# Altium schematic sheet 16_LMS2_RF2_Misc.SchDoc: LMS2 RF2 Misc
size A3; Organization: Lime Microsystems; Address1: Surrey Tech Centre; Address2: Guildford GU2 7YG; Address3: Surrey; Address4: United Kingdom; Revision: v1.1; SheetNumber: 16; SheetTotal: 31
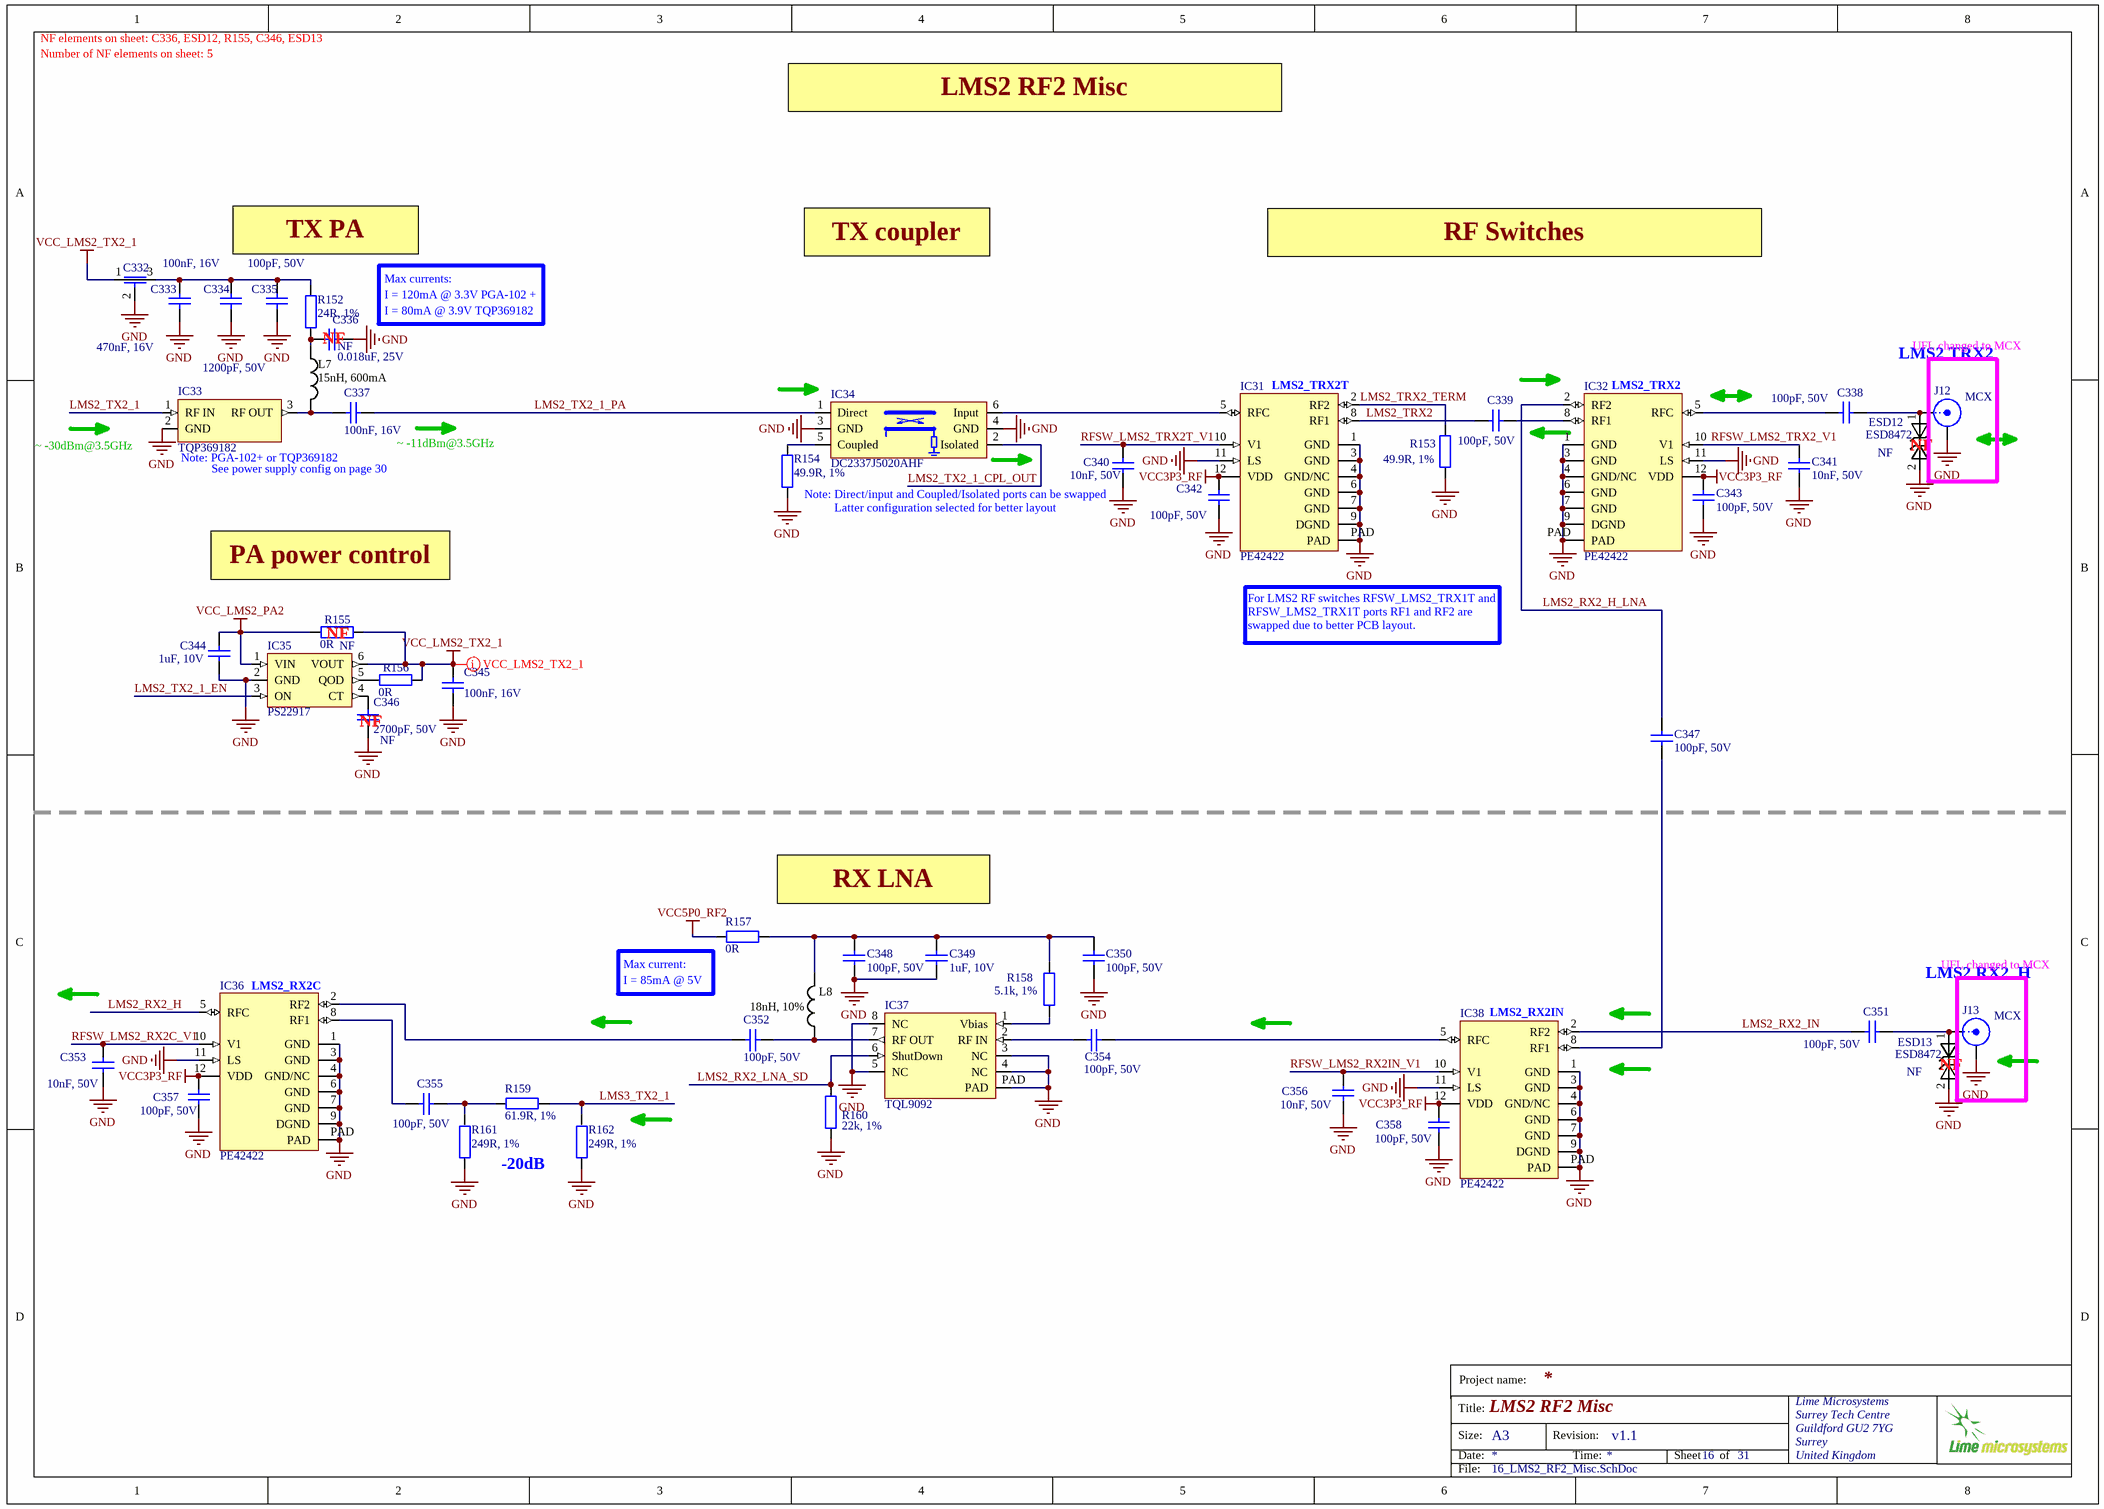
[diagram p0: 16_LMS2_RF2_Misc.SchDoc]

## Parts
C332  470nF, 16V  [CAP0805_FEEDTHROUGH]
C333  100nF, 16V  [CAP0402]
C334  1200pF, 50V  [CAP0402]
C335  100pF, 50V  [CAP0402]
C336  0.018uF, 25V  Assembly Info: NF  [CAP0402]
C337  100nF, 16V  [CAP0402]
C338  100pF, 50V  [CAP0402]
C339  100pF, 50V  [CAP0402]
C340  10nF, 50V  [CAP0402]
C341  10nF, 50V  [CAP0402]
C342  100pF, 50V  [CAP0402]
C343  100pF, 50V  [CAP0402]
C344  1uF, 10V  [CAP0402]
C345  100nF, 16V  [CAP0402]
C346  2700pF, 50V  Assembly Info: NF  [CAP0402]
C347  100pF, 50V  [CAP0402]
C348  100pF, 50V  [CAP0402]
C349  1uF, 10V  [CAP0402]
C350  100pF, 50V  [CAP0402]
C351  100pF, 50V  [CAP0402]
C352  100pF, 50V  [CAP0402]
C353  10nF, 50V  [CAP0402]
C354  100pF, 50V  [CAP0402]
C355  100pF, 50V  [CAP0402]
C356  10nF, 50V  [CAP0402]
C357  100pF, 50V  [CAP0402]
C358  100pF, 50V  [CAP0402]
ESD12  ESD8472  Assembly Info: NF  [ESD8472_X3DFN2]
ESD13  ESD8472  Assembly Info: NF  [ESD8472_X3DFN2]
IC31  PE42422  [PE42422_QFN12]
IC32  PE42422  [PE42422_QFN12]
IC33  TQP369182  [PGA-102+_SOT89]
IC34  DC2337J5020AHF  [DC2337J5020AHF_ANAREN_COUPLER_0805]
IC35  PS22917  [SOT23-6]
IC36  PE42422  [PE42422_QFN12]
IC37  TQL9092  [TQL9092]
IC38  PE42422  [PE42422_QFN12]
J12  MCX  [MCX_connector_vertical_SM]
J13  MCX  [MCX_connector_vertical_SM]
L7  15nH, 600mA  [RES0805]
L8  18nH, 10%  [RES0603]
R152  24R, 1%  [RES0402]
R153  49.9R, 1%  [RES0402]
R154  49.9R, 1%  [RES0402]
R155  0R  Assembly Info: NF  [RES0402]
R156  0R  [RES0402]
R157  0R  [RES0402]
R158  5.1k, 1%  [RES0603]
R159  61.9R, 1%  [RES0402]
R160  22k, 1%  [RES0402]
R161  249R, 1%  [RES0402]
R162  249R, 1%  [RES0402]

## Nets
GND: C332.2 C333.1 C334.2 C335.2 C336.2 C340.2 C341.2 C342.1 C343.1 C344.1 C345.1 C346.2 C348.2 C349.1 C350.2 C353.2 C356.2 C357.1 C358.1 ESD12.2 ESD13.2 IC31.1(GND) IC31.3(GND) IC31.4(GND/NC) IC31.6(GND) IC31.7(GND) IC31.9(DGND) IC31.11(LS) IC31.PAD IC32.1(GND) IC32.3(GND) IC32.4(GND/NC) IC32.6(GND) IC32.7(GND) IC32.9(DGND) IC32.11(LS) IC32.PAD IC33.2(GND) IC34.3(GND) IC34.4(GND) IC35.2(GND) IC36.1(GND) IC36.3(GND) IC36.4(GND/NC) IC36.6(GND) IC36.7(GND) IC36.9(DGND) IC36.11(LS) IC36.PAD IC37.3(NC) IC37.4(NC) IC37.5(NC) IC37.8(NC) IC37.PAD IC38.1(GND) IC38.3(GND) IC38.4(GND/NC) IC38.6(GND) IC38.7(GND) IC38.9(DGND) IC38.11(LS) IC38.PAD J12.2(Y) J13.2(Y) R153.2 R154.2 R160.1 R161.1 R162.1
VCC3P3_RF: C342.2 C343.2 C357.2 C358.2 IC31.12(VDD) IC32.12(VDD) IC36.12(VDD) IC38.12(VDD)
VCC5P0_RF2: R157.1
VCC_LMS2_PA2: C344.2 IC35.1(VIN) R155.2
VCC_LMS2_TX2_1: C332.1 C345.2 IC35.6(VOUT) R155.1 R156.1
LMS2_RX2_H: IC36.5(RFC)
LMS2_RX2_H_LNA: C347.2 IC32.2(RF2)
LMS2_RX2_IN: C351.1 IC38.2(RF2)
LMS2_RX2_LNA_SD: IC37.6(ShutDown) R160.2
LMS2_TRX2: C339.1 IC31.8(RF1)
LMS2_TRX2_TERM: IC31.2(RF2) R153.1
LMS2_TX2_1: IC33.1(RF_IN)
LMS2_TX2_1_CPL_OUT: IC34.2(Isolated)
LMS2_TX2_1_EN: IC35.3(ON)
LMS2_TX2_1_PA: C337.1 IC34.1(Direct)
LMS3_TX2_1: R159.2 R162.2
RFSW_LMS2_RX2C_V1: C353.1 IC36.10(V1)
RFSW_LMS2_RX2IN_V1: C356.1 IC38.10(V1)
RFSW_LMS2_TRX2_V1: C341.1 IC32.10(V1)
RFSW_LMS2_TRX2T_V1: C340.1 IC31.10(V1)
NetC332_3: C332.3 C333.2 C334.1 C335.1 R152.1
NetC336_1: C336.1 L7.1 R152.2
NetC337_2: C337.2 IC33.3(RF_OUT) L7.2
NetC338_1: C338.1 IC32.5(RFC)
NetC338_2: C338.2 ESD12.1 J12.1(X)
NetC339_2: C339.2 IC32.8(RF1)
NetC346_1: C346.1 IC35.4(CT)
NetC347_1: C347.1 IC38.8(RF1)
NetC348_1: C348.1 C349.2 C350.1 L8.1 R157.2 R158.2
NetC351_2: C351.2 ESD13.1 J13.1(X)
NetC352_1: C352.1 IC36.2(RF2)
NetC352_2: C352.2 IC37.7(RF_OUT) L8.2
NetC354_1: C354.1 IC37.2(RF_IN)
NetC354_2: C354.2 IC38.5(RFC)
NetC355_1: C355.1 R159.1 R161.2
NetC355_2: C355.2 IC36.8(RF1)
NetIC31_5: IC31.5(RFC) IC34.6(Input)
NetIC34_5: IC34.5(Coupled) R154.1
NetIC35_5: IC35.5(QOD) R156.2
NetIC37_1: IC37.1(Vbias) R158.1

## Layout directives
net class VCC_LMS2_TX2_2: VCC_LMS2_TX2_1

## Notes on the sheet
- NF elements on sheet: C336, ESD12, R155, C346, ESD13
- Number of NF elements on sheet: 5
- LMS2 RF2 Misc
- TX PA
- (near C332) Ch2
- I = 120mA @ 3.3V PGA-102 +
- Max currents:
- I = 80mA @ 3.9V TQP369182
- TX coupler
- RF Switches
- NF
- LMS2 TRX2
- UFL changed to MCX
- (near IC33) ~ -30dBm@3.5GHz
- (near C337) ~ -11dBm@3.5GHz
- (near IC31) LMS2_TRX2T
- (near IC32) LMS2_TRX2
- (near ESD12) NF
- (near IC33) Note: PGA-102+ or TQP369182
- See power supply config on page 30
- Note: Direct/input and Coupled/Isolated ports can be swapped
- (near C340) Latter configuration selected for better layout
- PA power control
- (near R155) NF
- (near IC31) For LMS2 RF switches RFSW_LMS2_TRX1T and RFSW_LMS2_TRX1T ports RF1 and RF2 are swapped due to better PCB layout.
- (near C346) NF
- RX LNA
- (near IC36) LMS2_RX2C
- I = 85mA @ 5V
- (near R157) Max current:
- LMS2 RX2_H
- (near IC38) LMS2_RX2IN
- (near ESD13) NF
- -20dB
- Project name:
- Title:
- Size:
- Date:
- A3
- Revision:
- Time:
- Sheet
- of
- File:

## Library data of the parts
C332 = Cap_feed_through: Part Description: 0.47µF Feed Through Capacitor 16V 2A 30mOhm 0805 (2012 Metric), 3 PC Pad; Manufacturer: Murata; Manufacturer Part Number 1: NFM21PC474R1C3D; Max Current Rating: 2A; Tolerance: 20%; DC Resistance (DCR): 30mR; Insulation Resistance: 1GR; Value: 470nF, 16V; Supplier 1: Digi-Key; Supplier Part Number 1: 490-2537-1-ND; Stock 1: 220606; Pricing 1: 1=0,25000, 10=0,22900, 25=0,21840, 50=0,21160, 100=0,20450, 250=0,19392, 500=0,16218, 1000=0,12586 (USD); Mount: Surface Mount,PCB; Case/Package: 0805; Weight: 0.000194oz; Case Code (Metric): 2012; Case Code (Imperial): 0805; Min Operating Temperature: -55°C; Max Operating Temperature: 125°C; Package Quantity: 1; Capacitance: 470nF; Packaging: Tape and Reel; Max Voltage Rating (DC): 16V; Current Rating: 2A; Voltage Rating: 16V; Voltage Rating (DC): 16V; Voltage: 16V; Current: 2A; Termination: Flat; Length: 2mm; Height: 0.85mm; Width: 1.25mm; Depth: 1.25mm; Radiation Hardening: No; REACH SVHC: No SVHC; Lead Free: Lead Free; RoHS: Yes
C333 C337 C345 = Cap_0402: Manufacturer: Murata Electronics; Manufacturer Part Number 1: GRM155R71C104KA88D; Part Description: 0.10µF ±10% 16V X7R Ceramic Capacitor -55°C ~ 125°C Surface Mount, MLCC 0402 (1005 Metric) 0.039" L x 0.020" W (1.00mm x 0.50mm); Tolerance: 10 %; Type: General Purpose MLCC; Capacitance: 0.1 uF; Case Length: 1 mm; Dielectric: X7R; Case Height: 0.5 mm; Temperature Coefficient / Code: +/- 15 %; Value: 100nF, 16V; Supplier 1: Mouser; Supplier Part Number 1: 81-GRM155R71C104KA88; Case Code - in: 0402; RoHS: RoHS Compliant; Operating Temperature Range: - 55 C to + 125 C; Series: GRM; Termination Style: SMD/SMT; Package / Case: 0402 (1005 metric); Voltage Rating DC: 16 V; Maximum Operating Temperature: + 125 C; Case Code - mm: 1005; Minimum Operating Temperature: - 55 C; Product Category: Low & Medium Capacitance SMD Ceramic Chip Capacitors; Packaging: Reel; Product: General Type MLCCs; Category: Multilayer Ceramic Capacitors MLCC - SMD/SMT; Brand: Murata Electronics; Case Width: 0.5 mm; RoHS - Mouser: Y; Standard Pack Qty: 10000; Minimum Order Quantity: 1; Reeling: True
C334 = Cap_0402: Manufacturer: Kemet; Manufacturer Part Number 1: C0402C122J5GACTU; Part Description: 1200pF ±5% 50V Ceramic Capacitor C0G, NP0 0402 (1005 Metric); Temperature Coefficient: C0G, NP0; Tolerance: ±5%; Value: 1200pF, 50V; Supplier 1: Digi-Key; Supplier Part Number 1: 399-7334-1-ND; Thickness (Max): 0.022" (0.55mm); Capacitance: 1200pF; Lead Spacing: -; Mounting Type: Surface Mount, MLCC; Package / Case: 0402 (1005 Metric); Category: Capacitors; Size / Dimension: 0.039" L x 0.020" W (1.00mm x 0.50mm); Voltage - Rated: 50V; Lead Style: -; Ratings: -; Features: -; Packaging: Cut Tape (CT); RoHS: RoHS Compliant; Operating Temperature: -55°C ~ 125°C; Applications: General Purpose; Height - Seated (Max): -
C335 C338 C339 C342 C343 C347 C348 C350-C352 C354 C355 C357 C358 = Cap_0402: Manufacturer Part Number 1: CC0402JRNPO9BN101; Manufacturer: Yageo; Part Description: 100pF ±5% 50V C0G, NP0 Ceramic Capacitor -55°C ~ 125°C Surface Mount, MLCC 0402 (1005 Metric) 0.039" L x 0.020" W (1.00mm x 0.50mm); Tolerance: ±5%; Temperature Coefficient: C0G, NP0; Value: 100pF, 50V; Capacitance: 100pF; Thickness (Max): 0.022" (0.55mm); Size / Dimension: 0.039" L x 0.020" W (1.00mm x 0.50mm); RoHS: RoHS Compliant; Ratings: -; Package / Case: 0402 (1005 Metric); Mounting Type: Surface Mount, MLCC; Height - Seated (Max): -; Features: -; Lead Spacing: -; Voltage - Rated: 50V; Operating Temperature: -55°C ~ 125°C; Packaging: Cut Tape (CT); Applications: General Purpose; Lead Style: -; Supplier 1: Digi-Key; Category: Capacitors; Supplier Part Number 1: 311-1024-1-ND
C336 = Cap_0402: Part Description: 0.018µF ±10% 25V Ceramic Capacitor X7R 0402 (1005 Metric); Manufacturer: Yageo; Manufacturer Part Number 1: CC0402KRX7R8BB183; Capacitance: 18nF; Tolerance: 10%; Dielectric: X7R; Value: 0.018uF, 25V; ComponentLink1URL: http://www.murata.com/~/media/webrenewal/support/library/catalog/products/capacitor/mlcc/c02e.ashx?la=en-us; ComponentLink1Description: http://www.murata.com/~/media/webrenewal/support/library/catalog/products/capacitor/mlcc/c02e.ashx?la=en-us; Supplier 1: Digi-Key; Supplier Part Number 1: 311-3345-1-ND; Stock 1: 39602; Pricing 1: 1=0,10000, 10=0,05000, 100=0,02210, 500=0,01580, 1000=0,01242, 2500=0,01129, 5000=0,01038 (USD); RoHS: Yes; Mount: Surface Mount; Case/Package: 0402; Min Operating Temperature: -55°C; Max Operating Temperature: 125°C; Packaging: Tape and Reel; Voltage Rating: 25V; Voltage Rating (DC): 25V; Length: 0.039inch; Width: 0.02inch; Thickness: 0.022inch; Lead Free: Lead Free; Halogen Free: Halogen Free; ComponentLink2URL: http://www.yageo.com/documents/recent/UPY-GPHC_X7R_6.3V-to-50V_18.pdf?src-supplier=Digi-Key; ComponentLink2Description: http://www.yageo.com/documents/recent/UPY-GPHC_X7R_6.3V-to-50V_18.pdf?src-supplier=Digi-Key; ComponentLink3URL: http://www.yageo.com/documents/recent/UPY-GPHC_X7R_6.3V-to-50V_16.pdf?src-supplier=Digi-Key; ComponentLink3Description: http://www.yageo.com/documents/recent/UPY-GPHC_X7R_6.3V-to-50V_16.pdf?src-supplier=Digi-Key
C340 C341 C353 C356 = Cap_0402: Part Description: 10000pF ±10% 50V Ceramic Capacitor X7R 0402 (1005 Metric); Manufacturer: Murata Electronics North America; Manufacturer Part Number 1: GRM155R71H103KA88D; Tolerance: ±10%; Temperature Coefficient: X7R; Value: 10nF, 50V; Supplier 1: Digi-Key; Supplier Part Number 1: 490-4516-2-ND; RoHS: RoHS Compliant; Category: Capacitors; Stock 1: 10970000; Pricing 1: 10000=0.00185, 20000=0.00176, 30000=0.00167 (USD); Packaging: Tape & Reel (TR); Part Status: Active; Voltage - Rated: 50V; Operating Temperature: -55°C ~ 125°C; Features: -; Ratings: -; Applications: General Purpose; Mounting Type: Surface Mount, MLCC; Package / Case: 0402 (1005 Metric); Size / Dimension: 0.039" L x 0.020" W (1.00mm x 0.50mm); Height - Seated (Max): -; Thickness (Max): 0.022" (0.55mm); Lead Spacing: -; Lead Style: -; ComponentLink1URL: http://www.murata.com/~/media/webrenewal/support/library/catalog/products/capacitor/mlcc/c02e.ashx?la=en-us; ComponentLink1Description: http://www.murata.com/~/media/webrenewal/support/library/catalog/products/capacitor/mlcc/c02e.ashx?la=en-us
C344 C349 = Cap_0402: Manufacturer Part Number 1: C1005X5R1E105K050BC; Manufacturer: TDK; Part Description: 1µF ±10% 10V X5R Ceramic Capacitor -55°C ~ 85°C Surface Mount, MLCC 0402 (1005 Metric) 0.039" L x 0.020" W (1.00mm x 0.50mm); Voltage Rating: 10; Capacitance Tolerance: ± 10%; Product Range: TDK - C Series; Ceramic Capacitor Case: 0402 [1005 Metric]; Capacitance: 1; Dielectric Characteristic: X6; Value: 1uF, 10V; Supplier 1: Digi-Key; Supplier Part Number 1: 445-9066-1-ND; MSL: -; RoHS: YES
C346 = Cap_0402: Manufacturer Part Number 1: GRM155R71H272KA01J; Manufacturer: Murata Electronics North America; Part Description: 2700pF ±10% 50V Ceramic Capacitor X7R 0402 (1005 Metric); Notification: Current market demand for these product types have resulted in fluctuating and extending lead times. Lead times may differ.; Tolerance: ±10%; Temperature Coefficient: X7R; Value: 2700pF, 50V; Size / Dimension: 0.039" L x 0.020" W (1.00mm x 0.50mm); Supplier 1: Digi-Key; Height - Seated (Max): -; Package / Case: 0402 (1005 Metric); Supplier Part Number 1: 490-6361-1-ND; Part Status: Active; RoHS: RoHS Compliant; Operating Temperature: -55°C ~ 125°C; Category: Capacitors; Ratings: -; Features: -; Packaging: Cut Tape (CT); Mounting Type: Surface Mount, MLCC; Voltage - Rated: 50V; Lead Spacing: -; Thickness (Max): 0.022" (0.55mm); Applications: General Purpose
ESD12 ESD13 = ESD8472: Manufacturer: ON Semiconductor; Manufacturer Part Number 1: ESD8472MUT5G; Part Description: TVS DIODE 5.3VWM 14VC X3DFN2; Voltage - Reverse Standoff (Typ): 5.3V (Max); Voltage - Breakdown (Min): 7V; Voltage - Clamping (Max) @ Ipp: 14V; Current - Peak Pulse (10/1000µs): 3A (8/20µs); Power Line Protection: No; Capacitance @ Frequency: 0.2pF @ 1MHz; Supplier 1: Digi-Key; RoHS: RoHS Compliant; Category: Circuit Protection; Stock 1: 2295; Pricing 1: 1=0.39, 10=0.315, 100=0.2142, 500=0.16068, 1000=0.12051 (USD); Packaging: Cut Tape (CT); Part Status: Active; Type: Zener; Power - Peak Pulse: -; Applications: Automotive, RF Antenna; Operating Temperature: -55°C ~ 150°C (TJ); Mounting Type: Surface Mount; Package / Case: 2-XFDFN; Supplier Device Package: 2-X3DFN (0.62x0.32); ComponentLink1URL: http://www.onsemi.com/pub/Collateral/ESD8472-D.PDF; ComponentLink1Description: http://www.onsemi.com/pub/Collateral/ESD8472-D.PDF; Supplier Part Number 1: ESD8472MUT5GOSCT-ND
IC31 IC32 IC36 IC38 = PE42422: Manufacturer: Peregrine Semiconductor; Manufacturer Part Number 1: PE42422MLAA-Z; Part Description: IC RF SWITCH SPDT 50 OHM 12QFN; Frequency - Lower: 100MHz; Isolation @ Frequency: 17dB @ 6GHz (typ); Insertion Loss @ Frequency: 0.9dB @ 6GHz; IIP3: 70dBm (typ); Topology: Reflective; Circuit: SPDT; Impedance: 50 Ohm; Voltage - Supply: 2.3 V ~ 5.5 V; RF Type: General Purpose; Supplier 1: Digi-Key; RoHS: RoHS Compliant; Category: RF/IF and RFID; Stock 1: 21993; Pricing 1: 1=1.32, 101=0.92 (USD); Packaging: Cut Tape (CT); Part Status: Active; P1dB: -; Features: -; Operating Temperature: -40°C ~ 85°C; Package / Case: 12-UFQFN Exposed Pad; Supplier Device Package: 12-QFN (2x2); ComponentLink1URL: http://www.psemi.com/pdf/datasheets/pe42422ds.pdf; ComponentLink1Description: http://www.psemi.com/pdf/datasheets/pe42422ds.pdf; Supplier Part Number 1: 1046-1062-1-ND
IC33 = PGA-102+_PA: Part Description: RF Amplifier DC-6GHz NF 3.9dB Gain 21.3dB 50 Ohm; Manufacturer: Qorvo; Manufacturer Part Number 1: TQP369182; Supplier Part Number 1: 772-TQP369182; Supplier 1: Mouser
IC34 = DC2337J5020AHF_coupler: Part Description: RF Directional Coupler General Purpose 2.3GHz ~ 3.7GHz 21.3dB 2W 0805 (2012 Metric); Manufacturer: Anaren; Supplier Part Number 1: 1173-1090-2-ND; Manufacturer Part Number 1: DC2337J5020AHF; Supplier 1: Digi-Key
IC35 = TPS22918: Part Description: Power Switch/Driver 1:1 P-Channel 2A SOT-23-6; Manufacturer: Texas Instruments; Manufacturer Part Number 1: TPS22917DBVR; Number of Channels: 1; Interface: On/Off; Fault Protection: Reverse Current; Output Configuration: High Side; Max Output Current: 2A; ComponentLink1URL: http://www.ti.com/lit/ds/symlink/tps22918.pdf; ComponentLink1Description: http://www.ti.com/lit/ds/symlink/tps22918.pdf; Supplier 1: Digi-Key; Supplier Part Number 1: 296-50498-1-ND; Stock 1: 29778; Pricing 1: 1=0,64, 10=0,545, 25=0,5084, 100=0,4066, 250=0,3776, 500=0,3195, 1000=0,24689 (USD); RoHS: Yes; Case/Package: SOT-23-6; Min Operating Temperature: -40°C; Max Operating Temperature: 125°C; Packaging: Cut Tape; Number of Outputs: 1; Series: -; RoHS Compliant: Yes; ComponentLink2URL: http://www.ti.com/lit/ds/symlink/tps22917.pdf?src-supplier=Digi-Key; ComponentLink2Description: http://www.ti.com/lit/ds/symlink/tps22917.pdf?src-supplier=Digi-Key
IC37 = TQL9092: Part Description: RF Amplifier .6-4.2GHz NF .6dB Flat Gain 2dB; Manufacturer: Qorvo; Manufacturer Part Number 1: TQL9092; Supplier 1: Mouser; Supplier Part Number 1: 772-TQL9092
J12 J13 = RF_IF_connector: Part Description: MCX Connector Jack, Female Socket 50 Ohms Surface Mount Solder; Manufacturer: Bel Cinch; Manufacturer Part Number 1: 133-3711-201; Description: Conn MCX RCP 0Hz to 6GHz 50Ohm Solder ST SMD Gold Over Nickel Stock; ComponentLink1URL: https://datasheet.ciiva.com/5177/c908-22101t-37976-5177328.pdf?src-supplier=Mouser; ComponentLink1Description: https://datasheet.ciiva.com/5177/c908-22101t-37976-5177328.pdf?src-supplier=Mouser; ComponentLink2URL: https://datasheet.ciiva.com/643/c908-22101t-643558.pdf?src-supplier=Digi-Key; ComponentLink2Description: https://datasheet.ciiva.com/643/c908-22101t-643558.pdf?src-supplier=Digi-Key; ComponentLink3URL: https://datasheet.ciiva.com/7662/1636995-7662651.pdf?src-supplier=Element14; ComponentLink3Description: https://datasheet.ciiva.com/7662/1636995-7662651.pdf?src-supplier=Element14; ComponentLink4URL: https://datasheet.ciiva.com/5689/c908-22101t-5689787.pdf?src-supplier=Farnell; ComponentLink4Description: https://datasheet.ciiva.com/5689/c908-22101t-5689787.pdf?src-supplier=Farnell; ComponentLink5URL: https://datasheet.ciiva.com/7996/691284-7996807.pdf?src-supplier=Element14; ComponentLink5Description: https://datasheet.ciiva.com/7996/691284-7996807.pdf?src-supplier=Element14; ComponentLink6URL: https://datasheet.ciiva.com/643/c908-22101t-643559.pdf?src-supplier=Digi-Key; ComponentLink6Description: https://datasheet.ciiva.com/643/c908-22101t-643559.pdf?src-supplier=Digi-Key; ComponentLink7URL: https://datasheet.ciiva.com/643/c908-22101t-643560.pdf?src-supplier=Digi-Key; ComponentLink7Description: https://datasheet.ciiva.com/643/c908-22101t-643560.pdf?src-supplier=Digi-Key; Supplier 1: Digikey; Supplier Part Number 1: J548-ND; Stock 1: 6208; Pricing 1: 1=2,86, 10=2,595, 25=2,4576, 50=2,4006, 100=2,2862, 250=2,01248 (USD); RoHS: Yes; Housing Material: 152ConductorMaterial; ComponentLink8URL: https://datasheet.ciiva.com/643/dr-1333711201-643313.pdf?src-supplier=Digikey; ComponentLink8Description: https://datasheet.ciiva.com/643/dr-1333711201-643313.pdf?src-supplier=Digikey; ComponentLink9URL: https://datasheet.ciiva.com/3131/pi-133-3711-201-3131233.pdf?src-supplier=Avnet; ComponentLink9Description: https://datasheet.ciiva.com/3131/pi-133-3711-201-3131233.pdf?src-supplier=Avnet; ComponentLink10URL: https://datasheet.ciiva.com/23817/1720439-23817678.pdf?src-supplier=Newark; ComponentLink10Description: https://datasheet.ciiva.com/23817/1720439-23817678.pdf?src-supplier=Newark; ComponentLink11URL: https://datasheet.ciiva.com/23769/249599-23769434.pdf?src-supplier=Newark; ComponentLink11Description: https://datasheet.ciiva.com/23769/249599-23769434.pdf?src-supplier=Newark; ComponentLink12URL: https://datasheet.ciiva.com/22686/1720437-22686743.pdf?src-supplier=Element14; ComponentLink12Description: https://datasheet.ciiva.com/22686/1720437-22686743.pdf?src-supplier=Element14
L7 = Inductor_0603: Manufacturer: Bourns; Manufacturer Part Number 1: CW201212-15NJ; Part Description: 15nH Unshielded Wirewound Inductor 600mA 80mOhm 0805 (2012 Metric); Core Material: Ceramic; Tolerance: 5%; Self Resonant Frequency: 3.6GHz; Shielding: Unshielded; Q Factor: 60; DC Resistance (DCR): 80mR; Test Frequency: 250MHz; Value: 15nH, 600mA; Supplier 1: Digi-Key; Supplier Part Number 1: CW201212-15NJDKR-ND; Stock 1: 2733; Pricing 1: 1=0.37, 10=0.327, 100=0.2245, 500=0.19188, 1000=0.14697 (USD); Mount: Surface Mount; Case/Package: 0805; Weight: 0.000194oz; Case Code (Metric): 2012; Case Code (Imperial): 0805; Min Operating Temperature: -40°C; Max Operating Temperature: 125°C; Package Quantity: 2000; Packaging: Tape and Reel; Current Rating: 600mA; Inductance: 15nH; Max DC Current: 600mA; Termination: SMD/SMT; Composition: Wirewound,Ceramic; DC Current: 600mA; Military Standard: Not; Length: 0.083inch; Height: 0.051inch; Width: 1.5mm; Height - Seated (Max): 0.059inch; Depth: 1.7mm; Radiation Hardening: No; ComponentLink1URL: http://www.bourns.com/data/global/PDFs/CW201212.pdf?src-supplier=Avnet+Europe; ComponentLink1Description: http://www.bourns.com/data/global/PDFs/CW201212.pdf?src-supplier=Avnet+Europe; ComponentLink2URL: http://www.bourns.com/data/global/pdfs/CW201212.pdf?src-supplier=Digi-Key; ComponentLink2Description: http://www.bourns.com/data/global/pdfs/CW201212.pdf?src-supplier=Digi-Key; ComponentLink3URL: http://www.bourns.com/data/global/PDFs/CW201212.pdf?src-supplier=Avnet; ComponentLink3Description: http://www.bourns.com/data/global/PDFs/CW201212.pdf?src-supplier=Avnet; ComponentLink4URL: http://www.onlinecomponents.com/productFiles/mf-BO/cw201212.pdf?src-supplier=Onlinecomponents.com; ComponentLink4Description: http://www.onlinecomponents.com/productFiles/mf-BO/cw201212.pdf?src-supplier=Onlinecomponents.com
L8 = Inductor: Part Description: 18nH Unshielded Wirewound Inductor 700mA 170 mOhm Max 0603 (1608 Metric); Manufacturer: Pulse Electronics Network; Manufacturer Part Number 1: PE-0603CD180KTT; Type: Wirewound; Material - Core: Ceramic; Shielding: Unshielded; DC Resistance (DCR): 170 mOhm Max; Q @ Freq: 35 @ 180MHz; Value: 18nH, 10%; Supplier 1: Digi-Key; Supplier Part Number 1: 1840-1105-1-ND; RoHS: RoHS Compliant; Category: Inductors, Coils, Chokes; Stock 1: 14000; Pricing 1: 1=0.41, 10=0.368, 100=0.253, 500=0.2162, 1000=0.1656 (USD); Packaging: Cut Tape (CT); Part Status: Active; Tolerance: ±10%; Ratings: -; Operating Temperature: -40°C ~ 125°C; Mounting Type: Surface Mount; Package / Case: 0603 (1608 Metric); Supplier Device Package: 0603 (1608 Metric); Size / Dimension: 0.071" L x 0.049" W (1.80mm x 1.24mm); Height - Seated (Max): 0.040" (1.02mm); ComponentLink1URL: http://productfinder.pulseeng.com/products/datasheets/WC701.pdf; ComponentLink1Description: http://productfinder.pulseeng.com/products/datasheets/WC701.pdf
R152 = Res_0402: Manufacturer: Yageo; Manufacturer Part Number 1: AC0402FR-0724RL; Part Description: 24 Ohms ±1% 0.063W, 1/16W Chip Resistor 0402 (1005 Metric) Automotive AEC-Q200, Moisture Resistant Thick Film; Max Power Dissipation: 63mW; Temperature Coefficient: 100ppm/°C; Value: 24R, 1%; Supplier 1: Digi-Key; Supplier Part Number 1: 13-AC0402FR-0724RLCT-ND; Stock 1: 14420; Pricing 1: 1=0.1, 10=0.022, 100=0.009, 1000=0.00402, 2500=0.00349, 5000=0.00288 (USD); Case/Package: 0402; Min Operating Temperature: -55°C; Max Operating Temperature: 155°C; Packaging: Tape and Reel; Resistance: 24R; Resistor Type: Thick Film; Number of Terminations: 2; Tolerance: 1%; Features: Moisture Resistant,Automotive AEC-Q200; Length: 0.039inch; Width: 0.02inch; Height: 0.015inch; RoHS Compliant: Yes; ComponentLink1URL: http://www.yageo.com/NewPortal/yageodocoutput?fileName=/pdf/R-Chip/PYu-AC_51_RoHS_L_6.pdf&src-supplier=Digi-Key; ComponentLink1Description: http://www.yageo.com/NewPortal/yageodocoutput?fileName=/pdf/R-Chip/PYu-AC_51_RoHS_L_6.pdf&src-supplier=Digi-Key
R153 R154 = Res_0402: Manufacturer: Samsung Electro-Mechanics America, Inc.; Manufacturer Part Number: RC1005F49R9CS; Part Description: RES SMD 49.9 OHM 1% 1/16W 0402; Temperature Coefficient: ±100ppm/°C; Resistance (Ohms): 49.9; Power (Watts): 0.063W, 1/16W; Number of Terminations: 2; Size / Dimension: 0.039" L x 0.020" W (1.00mm x 0.50mm); Supplier Device Package: 0402 (1005 Metric); RoHS: RoHS Compliant; Supplier Part Number 1: 1276-3469-6-ND; Features: -; Packaging: Digi-Reel®; Tolerance: ±1%; Height: 0.016" (0.40mm); Category: Resistors; Composition: Thick Film; Package / Case: 0402 (1005 Metric); Supplier 1: Digi-Key; Operating Temperature: -55°C ~ 155°C; Value: 49.9R, 1%; Manufacturer Part Number 1: RC1005F49R9CS
R155-R157 = Res_0402: Manufacturer Part Number 1: RC0402JR-070RL; Manufacturer: Yageo; Part Description: RES SMD 0.0OHM JUMPER 1/16W 0402; Resistance (Ohms): 0.0; Tolerance: Jumper; Power (Watts): 0.063W, 1/16W; Value: 0R; Supplier 1: Digi-Key; Supplier Part Number 1: 311-0.0JRTR-ND; Category: Resistors; Temperature Coefficient: -; Features: Moisture Resistant; Supplier Device Package: 0402; Height: 0.016" (0.40mm); Package / Case: 0402 (1005 Metric); Operating Temperature: -55°C ~ 155°C; Size / Dimension: 0.039" L x 0.020" W (1.00mm x 0.50mm); Composition: Thick Film; Packaging: Tape & Reel (TR); Number of Terminations: 2; RoHS: RoHS Compliant
R158 = Res_0603: Part Description: 5.1 kOhms ±1% 0.1W, 1/10W Chip Resistor 0603 (1608 Metric) Automotive AEC-Q200 Thick Film; Manufacturer: Stackpole Electronics; Manufacturer Part Number 1: RMCF0603FT5K10; Resistance: 5.1kR; Max Power Dissipation: 100mW; Temperature Coefficient: 100ppm/°C; Value: 5.1k, 1%; ComponentLink1URL: https://industrial.panasonic.com/cdbs/www-data/pdf/RDA0000/AOA0000C304.pdf; ComponentLink1Description: https://industrial.panasonic.com/cdbs/www-data/pdf/RDA0000/AOA0000C304.pdf; Supplier 1: Digi-Key; Supplier Part Number 1: RMCF0603FT5K10CT-ND; Stock 1: 1507174; Pricing 1: 1=0,10000, 10=0,01500, 100=0,00610, 1000=0,00273, 2500=0,00237 (USD); RoHS: Yes; Mount: Surface Mount; Case/Package: 0603; Case Code (Metric): 1608; Case Code (Imperial): 0603; Contact Plating: Tin,Matte; Min Operating Temperature: -55°C; Max Operating Temperature: 155°C; Tolerance: 1%; Packaging: Tape and Reel; Resistor Type: Thick Film; Number of Terminations: 2; Features: Automotive AEC-Q200; Series: RMCF; Length: 0.061inch; Width: 0.031inch; Height: 0.022inch; Radiation Hardening: No; RoHS Compliant: Yes; ComponentLink2URL: http://components.arrow.com/part/dataview/50863347S9465827N1174?src-supplier=Arrow+Electronics; ComponentLink2Description: http://components.arrow.com/part/dataview/50863347S9465827N1174?src-supplier=Arrow+Electronics; ComponentLink3URL: https://www.seielect.com/catalog/SEI-RMCF_RMCP.pdf?src-supplier=Avnet; ComponentLink3Description: https://www.seielect.com/catalog/SEI-RMCF_RMCP.pdf?src-supplier=Avnet; ComponentLink4URL: https://www.seielect.com/catalog/SEI-Packaging.pdf?src-supplier=Digi-Key; ComponentLink4Description: https://www.seielect.com/catalog/SEI-Packaging.pdf?src-supplier=Digi-Key
R159 = Res_0402: Part Description: 61.9 Ohms ±1% 0.063W, 1/16W Chip Resistor 0402 (1005 Metric) Moisture Resistant Thick Film; Manufacturer: Yageo; Manufacturer Part Number 1: RC0402FR-0761R9L; Power Rating: 62.5mW; Voltage Rating: 50V; Temperature Coefficient: 100ppm/°C; Max Power Dissipation: 63mW; Value: 61.9R, 1%; ComponentLink1URL: https://datasheet.ciiva.com/12577/pyu-rc0402-51-rohs-l-6-r-12577388.pdf?src-supplier=Mouser; ComponentLink1Description: https://datasheet.ciiva.com/12577/pyu-rc0402-51-rohs-l-6-r-12577388.pdf?src-supplier=Mouser; ComponentLink2URL: https://datasheet.ciiva.com/17332/pyu-rc0402-51-rohs-l-6-17332587.pdf?src-supplier=Future+Electronics; ComponentLink2Description: https://datasheet.ciiva.com/17332/pyu-rc0402-51-rohs-l-6-17332587.pdf?src-supplier=Future+Electronics; Supplier 1: Digi-Key; Supplier Part Number 1: 311-61.9LRCT-ND; Stock 1: 93771; Pricing 1: 1=0,10000, 10=0,01600, 100=0,00660, 1000=0,00299, 2500=0,00259, 5000=0,00214 (USD); RoHS: Yes; Case/Package: 0402; Case Code (Imperial): 0402; Case Code (Metric): 1005; Contact Plating: Tin,Matte,Lead; Min Operating Temperature: -55°C; Max Operating Temperature: 155°C; Package Quantity: 1; Resistance: 61.9R; Tolerance: 1%; Packaging: Tape and Reel; Termination: SMD/SMT; Resistor Type: Thick Film; Number of Terminations: 2; Voltage Rating (DC): 50V; Working Voltage: 50V; Features: Moisture Resistant; Series: RC; Construction: Rectangular; Technology: THICK FILM; Length: 1mm; Width: 0.5mm; Height: 0.016inch; Depth: 0.5mm; Radiation Hardening: No; Military Standard: Not; Lead Free: Lead Free; RoHS Compliant: Yes; ComponentLink3URL: https://datasheet.ciiva.com/2453/pyu-r-int-thick-7-2453707.pdf?src-supplier=Digi-Key; ComponentLink3Description: https://datasheet.ciiva.com/2453/pyu-r-int-thick-7-2453707.pdf?src-supplier=Digi-Key; ComponentLink4URL: https://datasheet.ciiva.com/2453/pyu-r-int-thick-7-2453708.pdf?src-supplier=Digi-Key; ComponentLink4Description: https://datasheet.ciiva.com/2453/pyu-r-int-thick-7-2453708.pdf?src-supplier=Digi-Key; ComponentLink5URL: https://datasheet.ciiva.com/2453/pyu-r-int-thick-7-2453706.pdf?src-supplier=Digi-Key; ComponentLink5Description: https://datasheet.ciiva.com/2453/pyu-r-int-thick-7-2453706.pdf?src-supplier=Digi-Key; ComponentLink6URL: https://datasheet.ciiva.com/8888/pyu-rc0402-51-rohs-l-6-8888591.pdf?src-supplier=Avnet; ComponentLink6Description: https://datasheet.ciiva.com/8888/pyu-rc0402-51-rohs-l-6-8888591.pdf?src-supplier=Avnet; ComponentLink7URL: https://datasheet.ciiva.com/16741/pyu-rc0402-51-rohs-l-6-r-16741941.pdf?src-supplier=Future+Electronics; ComponentLink7Description: https://datasheet.ciiva.com/16741/pyu-rc0402-51-rohs-l-6-r-16741941.pdf?src-supplier=Future+Electronics; ComponentLink8URL: https://datasheet.ciiva.com/15189/getdatasheetpartid-325045-15189495.pdf?src-supplier=Verical; ComponentLink8Description: https://datasheet.ciiva.com/15189/getdatasheetpartid-325045-15189495.pdf?src-supplier=Verical
R160 = Res_0402: Manufacturer: Yageo; Part Description: RES SMD 22K OHM 1% 1/16W 0402; Manufacturer Part Number 1: RC0402FR-0722KL; Temperature Coefficient: ±100ppm/°C; Power (Watts): 0.063W, 1/16W; Value: 22k, 1%; Number of Terminations: 2; Operating Temperature: -55°C ~ 155°C; Package / Case: 0402 (1005 Metric); Category: Resistors; Size / Dimension: 0.039" L x 0.020" W (1.00mm x 0.50mm); Height: 0.016" (0.40mm); Supplier 1: Digi-Key; Supplier Part Number 1: 311-22.0KLRCT-ND; RoHS: RoHS Compliant; Features: Moisture Resistant; Packaging: Cut Tape (CT); Composition: Thick Film; Supplier Device Package: 0402; Resistance (Ohms): 22k; Tolerance: ±1%
R161 R162 = Res_0402: Manufacturer: Stackpole Electronics Inc; Manufacturer Part Number 1: RMCF0402FT249R; Part Description: RES SMD 249 OHM 1% 1/16W 0402; Power (Watts): 0.063W, 1/16W; Resistance (Ohms): 249; Temperature Coefficient: ±100ppm/°C; Value: 249R, 1%; Category: Resistors; Composition: Thick Film; Features: -; Height: 0.016" (0.40mm); Number of Terminations: 2; Operating Temperature: -55°C ~ 155°C; Package / Case: 0402 (1005 Metric); Packaging: Cut Tape (CT); RoHS: RoHS Compliant; Size / Dimension: 0.039" L x 0.020" W (1.00mm x 0.50mm); Supplier 1: Digi-Key; Supplier Device Package: 0402; Supplier Part Number 1: RMCF0402FT249RCT-ND; Tolerance: ±1%